# Altium schematic sheet motor-drive.SchDoc
size A3
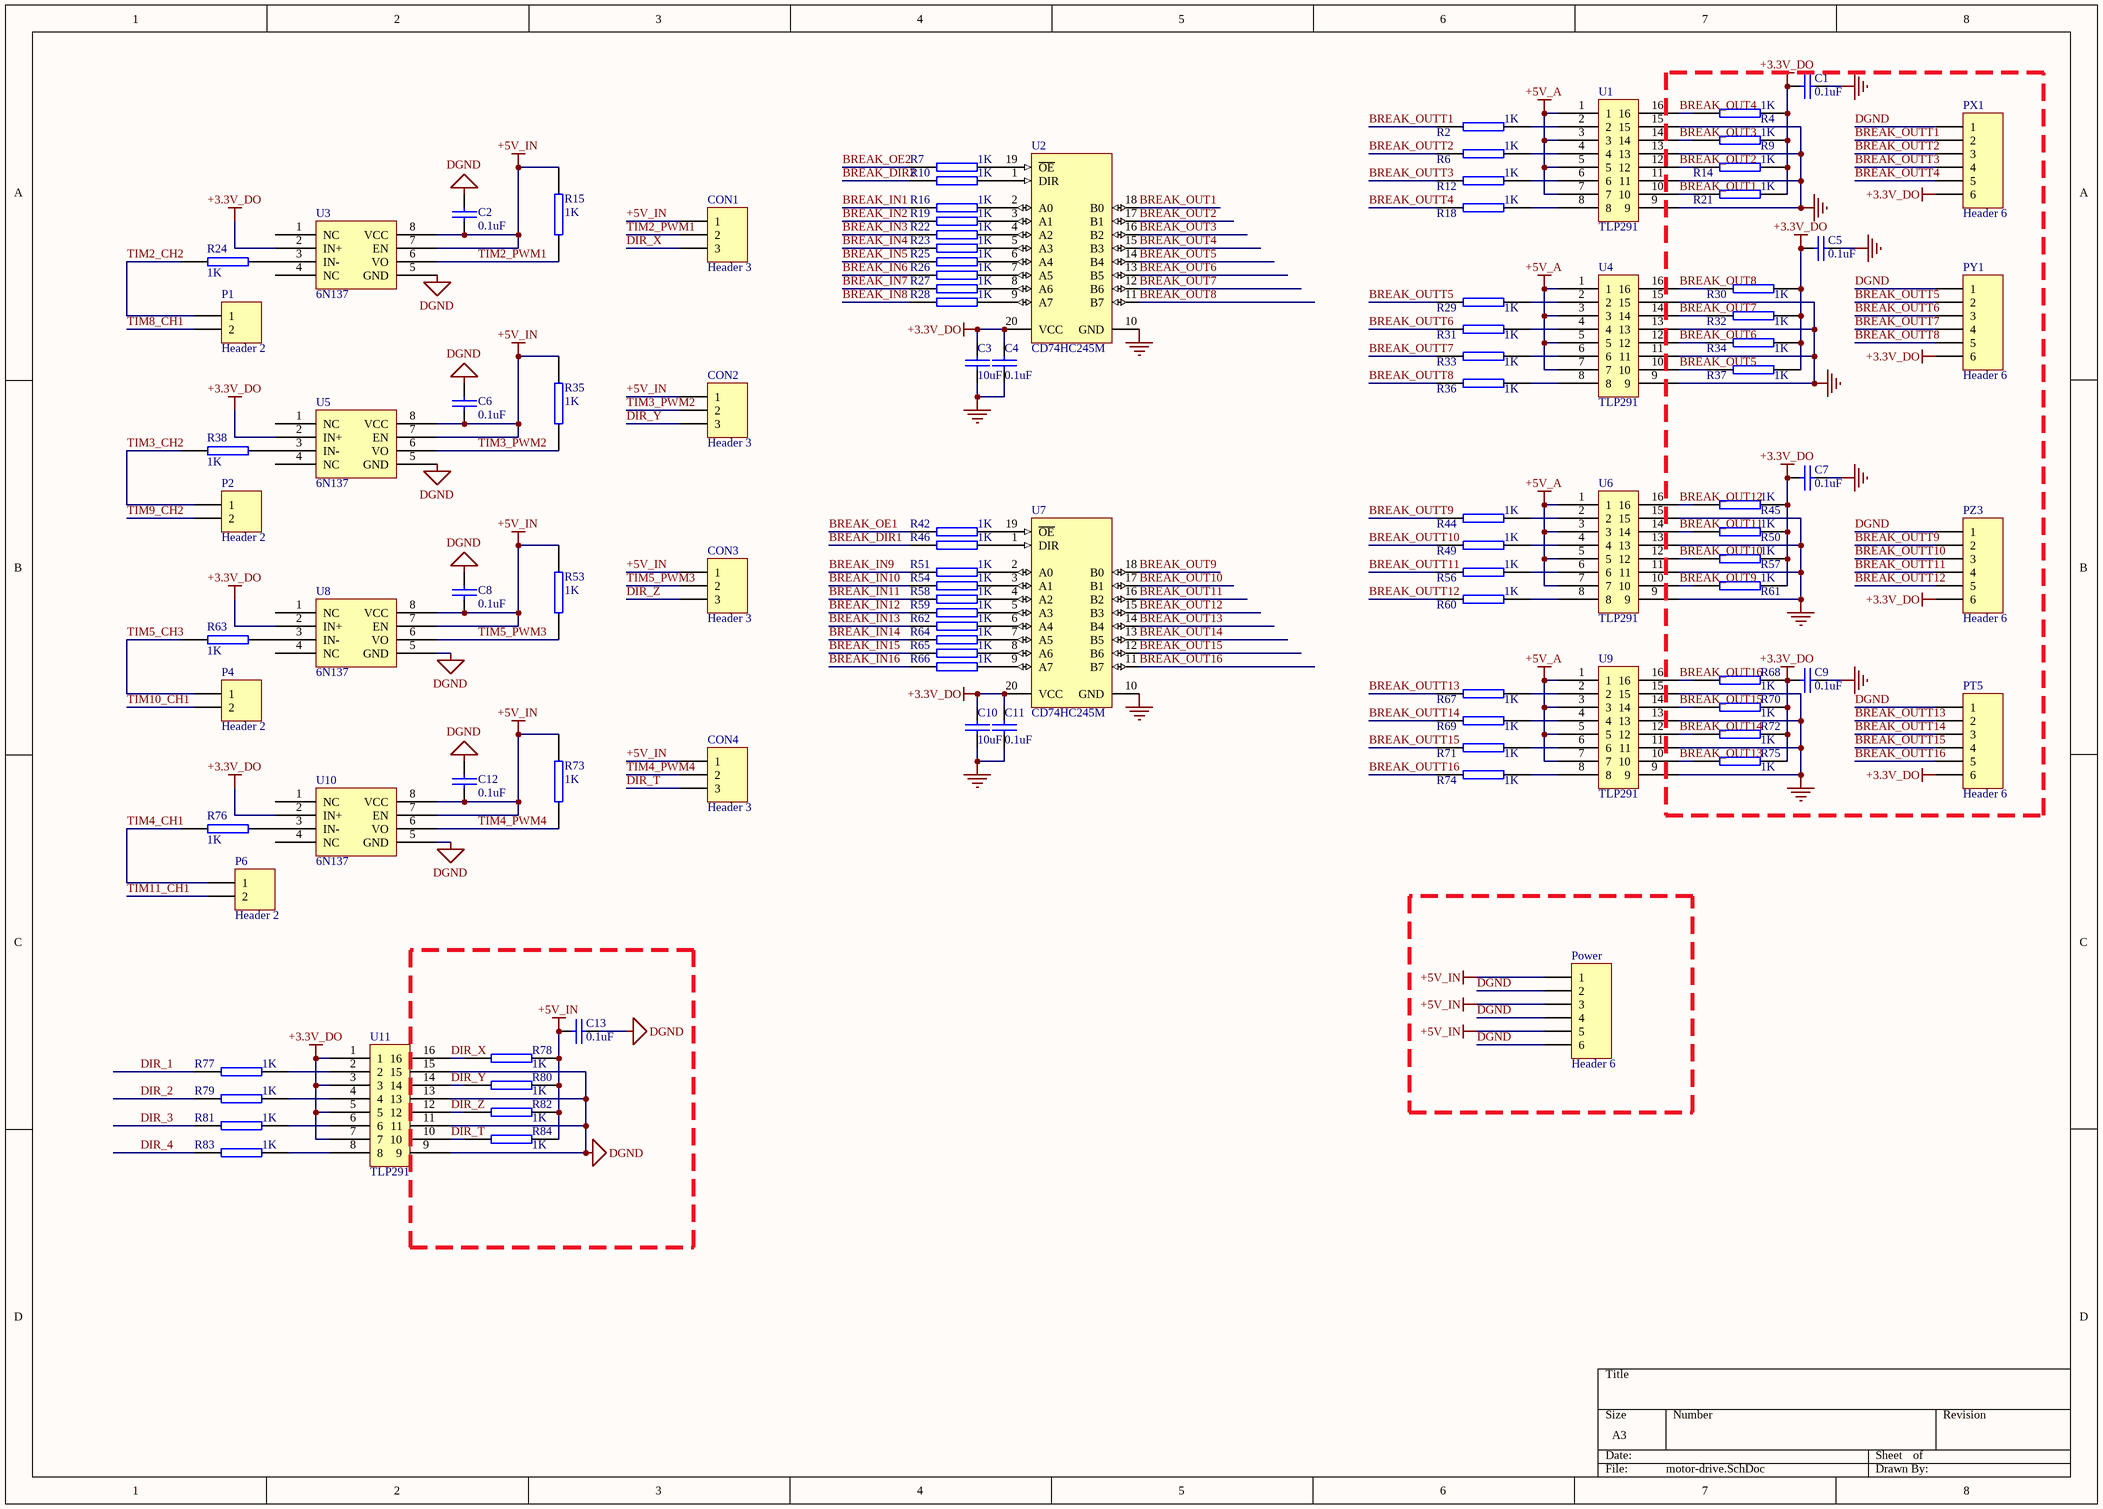
[diagram p0: motor-drive.SchDoc]

## Parts
C1  0.1uF  [0805]
C2  0.1uF  [0805]
C3  10uF  [0805]
C4  0.1uF  [0805]
C5  0.1uF  [0805]
C6  0.1uF  [0805]
C7  0.1uF  [0805]
C8  0.1uF  [0805]
C9  0.1uF  [0805]
C10  10uF  [0805]
C11  0.1uF  [0805]
C12  0.1uF  [0805]
C13  0.1uF  [0805]
CON1  Header 3  [CON3]
CON2  Header 3  [CON3]
CON3  Header 3  [CON3]
CON4  Header 3  [CON3]
P1  Header 2  [HDR1X2]
P2  Header 2  [HDR1X2]
P4  Header 2  [HDR1X2]
P6  Header 2  [HDR1X2]
Power  Header 6  [HDR1X6]
PT5  Header 6  [HDR1X6]
PX1  Header 6  [HDR1X6]
PY1  Header 6  [HDR1X6]
PZ3  Header 6  [HDR1X6]
R2  1K  [0805]
R4  1K  [0805]
R6  1K  [0805]
R7  1K  [0805]
R9  1K  [0805]
R10  1K  [0805]
R12  1K  [0805]
R14  1K  [0805]
R15  1K  [0805]
R16  1K  [0805]
R18  1K  [0805]
R19  1K  [0805]
R21  1K  [0805]
R22  1K  [0805]
R23  1K  [0805]
R24  1K  [0805]
R25  1K  [0805]
R26  1K  [0805]
R27  1K  [0805]
R28  1K  [0805]
R29  1K  [0805]
R30  1K  [0805]
R31  1K  [0805]
R32  1K  [0805]
R33  1K  [0805]
R34  1K  [0805]
R35  1K  [0805]
R36  1K  [0805]
R37  1K  [0805]
R38  1K  [0805]
R42  1K  [0805]
R44  1K  [0805]
R45  1K  [0805]
R46  1K  [0805]
R49  1K  [0805]
R50  1K  [0805]
R51  1K  [0805]
R53  1K  [0805]
R54  1K  [0805]
R56  1K  [0805]
R57  1K  [0805]
R58  1K  [0805]
R59  1K  [0805]
R60  1K  [0805]
R61  1K  [0805]
R62  1K  [0805]
R63  1K  [0805]
R64  1K  [0805]
R65  1K  [0805]
R66  1K  [0805]
R67  1K  [0805]
R68  1K  [0805]
R69  1K  [0805]
R70  1K  [0805]
R71  1K  [0805]
R72  1K  [0805]
R73  1K  [0805]
R74  1K  [0805]
R75  1K  [0805]
R76  1K  [0805]
R77  1K  [0805]
R78  1K  [0805]
R79  1K  [0805]
R80  1K  [0805]
R81  1K  [0805]
R82  1K  [0805]
R83  1K  [0805]
R84  1K  [0805]
U1  TLP291  [SOIC-TLP291-4-16N]
U2  CD74HC245M  [DW0020A_N]
U3  6N137  [SO-8]
U4  TLP291  [SOIC-TLP291-4-16N]
U5  6N137  [SO-8]
U6  TLP291  [SOIC-TLP291-4-16N]
U7  CD74HC245M  [DW0020A_N]
U8  6N137  [SO-8]
U9  TLP291  [SOIC-TLP291-4-16N]
U10  6N137  [SO-8]
U11  TLP291  [SOIC-TLP291-4-16N]

## Nets
+3.3V_DO: C1.1 C3.1 C4.2 C5.1 C7.1 C9.1 C10.1 C11.2 PT5.6 PX1.6 PY1.6 PZ3.6 R4.1 R9.1 R14.1 R21.1 R30.1 R32.1 R34.1 R37.1 R45.1 R50.1 R57.1 R61.1 R68.1 R70.1 R72.1 R75.1 U2.20(VCC) U3.2(IN+) U5.2(IN+) U7.20(VCC) U8.2(IN+) U10.2(IN+) U11.1 U11.3 U11.5 U11.7
+5V_A: U1.1 U1.3 U1.5 U1.7 U4.1 U4.3 U4.5 U4.7 U6.1 U6.3 U6.5 U6.7 U9.1 U9.3 U9.5 U9.7
+5V_IN: C2.2 C6.2 C8.2 C12.2 C13.1 CON1.1 CON2.1 CON3.1 CON4.1 Power.1 Power.3 Power.5 R15.2 R35.2 R53.2 R73.2 R78.2 R80.1 R82.1 R84.1 U3.7(EN) U3.8(VCC) U5.7(EN) U5.8(VCC) U8.7(EN) U8.8(VCC) U10.7(EN) U10.8(VCC)
DGND: C1.2 C2.1 C3.2 C4.1 C5.2 C6.1 C7.2 C8.1 C9.2 C10.2 C11.1 C12.1 C13.2 Power.2 Power.4 Power.6 PT5.1 PX1.1 PY1.1 PZ3.1 U1.9 U1.11 U1.13 U1.15 U2.10(GND) U3.5(GND) U4.9 U4.11 U4.13 U4.15 U5.5(GND) U6.9 U6.11 U6.13 U6.15 U7.10(GND) U8.5(GND) U9.9 U9.11 U9.13 U9.15 U10.5(GND) U11.9 U11.11 U11.13 U11.15
BREAK_DIR1: R46.1
BREAK_DIR2: R10.1
BREAK_IN1: R16.1
BREAK_IN2: R19.1
BREAK_IN3: R22.1
BREAK_IN4: R23.1
BREAK_IN5: R25.1
BREAK_IN6: R26.1
BREAK_IN7: R27.1
BREAK_IN8: R28.1
BREAK_IN9: R51.1
BREAK_IN10: R54.1
BREAK_IN11: R58.1
BREAK_IN12: R59.1
BREAK_IN13: R62.1
BREAK_IN14: R64.1
BREAK_IN15: R65.1
BREAK_IN16: R66.1
BREAK_OE1: R42.1
BREAK_OE2: R7.1
BREAK_OUT1: R21.2 U1.10 U2.18(B0)
BREAK_OUT2: R14.2 U1.12 U2.17(B1)
BREAK_OUT3: R9.2 U1.14 U2.16(B2)
BREAK_OUT4: R4.2 U1.16 U2.15(B3)
BREAK_OUT5: R37.2 U2.14(B4) U4.10
BREAK_OUT6: R34.2 U2.13(B5) U4.12
BREAK_OUT7: R32.2 U2.12(B6) U4.14
BREAK_OUT8: R30.2 U2.11(B7) U4.16
BREAK_OUT9: R61.2 U6.10 U7.18(B0)
BREAK_OUT10: R57.2 U6.12 U7.17(B1)
BREAK_OUT11: R50.2 U6.14 U7.16(B2)
BREAK_OUT12: R45.2 U6.16 U7.15(B3)
BREAK_OUT13: R75.2 U7.14(B4) U9.10
BREAK_OUT14: R72.2 U7.13(B5) U9.12
BREAK_OUT15: R70.2 U7.12(B6) U9.14
BREAK_OUT16: R68.2 U7.11(B7) U9.16
BREAK_OUTT1: PX1.2 R2.2
BREAK_OUTT2: PX1.3 R6.2
BREAK_OUTT3: PX1.4 R12.2
BREAK_OUTT4: PX1.5 R18.2
BREAK_OUTT5: PY1.2 R29.2
BREAK_OUTT6: PY1.3 R31.2
BREAK_OUTT7: PY1.4 R33.2
BREAK_OUTT8: PY1.5 R36.2
BREAK_OUTT9: PZ3.2 R44.2
BREAK_OUTT10: PZ3.3 R49.2
BREAK_OUTT11: PZ3.4 R56.2
BREAK_OUTT12: PZ3.5 R60.2
BREAK_OUTT13: PT5.2 R67.2
BREAK_OUTT14: PT5.3 R69.2
BREAK_OUTT15: PT5.4 R71.2
BREAK_OUTT16: PT5.5 R74.2
DIR_1: R77.2
DIR_2: R79.2
DIR_3: R81.2
DIR_4: R83.2
DIR_T: CON4.3 R84.2 U11.10
DIR_X: CON1.3 R78.1 U11.16
DIR_Y: CON2.3 R80.2 U11.14
DIR_Z: CON3.3 R82.2 U11.12
TIM2_CH2: P1.1 R24.1
TIM2_PWM1: CON1.2 R15.1 U3.6(VO)
TIM3_CH2: P2.1 R38.1
TIM3_PWM2: CON2.2 R35.1 U5.6(VO)
TIM4_CH1: P6.1 R76.1
TIM4_PWM4: CON4.2 R73.1 U10.6(VO)
TIM5_CH3: P4.1 R63.1
TIM5_PWM3: CON3.2 R53.1 U8.6(VO)
TIM8_CH1: P1.2
TIM9_CH2: P2.2
TIM10_CH1: P4.2
TIM11_CH1: P6.2
NetR2_1: R2.1 U1.2
NetR6_1: R6.1 U1.4
NetR7_2: R7.2 U2.19(~{OE})
NetR10_2: R10.2 U2.1(DIR)
NetR12_1: R12.1 U1.6
NetR16_2: R16.2 U2.2(A0)
NetR18_1: R18.1 U1.8
NetR19_2: R19.2 U2.3(A1)
NetR22_2: R22.2 U2.4(A2)
NetR23_2: R23.2 U2.5(A3)
NetR24_2: R24.2 U3.3(IN-)
NetR25_2: R25.2 U2.6(A4)
NetR26_2: R26.2 U2.7(A5)
NetR27_2: R27.2 U2.8(A6)
NetR28_2: R28.2 U2.9(A7)
NetR29_1: R29.1 U4.2
NetR31_1: R31.1 U4.4
NetR33_1: R33.1 U4.6
NetR36_1: R36.1 U4.8
NetR38_2: R38.2 U5.3(IN-)
NetR42_2: R42.2 U7.19(~{OE})
NetR44_1: R44.1 U6.2
NetR46_2: R46.2 U7.1(DIR)
NetR49_1: R49.1 U6.4
NetR51_2: R51.2 U7.2(A0)
NetR54_2: R54.2 U7.3(A1)
NetR56_1: R56.1 U6.6
NetR58_2: R58.2 U7.4(A2)
NetR59_2: R59.2 U7.5(A3)
NetR60_1: R60.1 U6.8
NetR62_2: R62.2 U7.6(A4)
NetR63_2: R63.2 U8.3(IN-)
NetR64_2: R64.2 U7.7(A5)
NetR65_2: R65.2 U7.8(A6)
NetR66_2: R66.2 U7.9(A7)
NetR67_1: R67.1 U9.2
NetR69_1: R69.1 U9.4
NetR71_1: R71.1 U9.6
NetR74_1: R74.1 U9.8
NetR76_2: R76.2 U10.3(IN-)
NetR77_1: R77.1 U11.2
NetR79_1: R79.1 U11.4
NetR81_1: R81.1 U11.6
NetR83_1: R83.1 U11.8

Not connected (* = marked no-connect by the designer): U3 1(NC) 4(NC); U5 1(NC) 4(NC); U8 1(NC) 4(NC); U10 1(NC) 4(NC)

## Library data of the parts
C1-C13 = CAP: Capacitor
CON1-CON4 = Header 3: Header, 3-Pin; Revision: 17-Jul-2002: Re-released for DXP Platform.; Publisher: Altium Limited
P1 P2 P4 P6 = Header 2: Header, 2-Pin; LatestRevisionDate: 17-Jul-2002; LatestRevisionNote: Re-released for DXP Platform.; Publisher: Altium Limited
Power PT5 PX1 PY1 PZ3 = Header 6: Header, 6-Pin; LatestRevisionDate: 17-Jul-2002; LatestRevisionNote: Re-released for DXP Platform.; Publisher: Altium Limited
R2 R4 R6 R7 R9 R10 R12 R14-R16 R18 R19 R21-R38 R42 R44-R46 R49-R51 R53 R54 R56-R84 = RES2
U1 U4 U6 U9 U11 = TLP291-4: 光耦隔离
U2 U7 = CD74HC245M: High Speed CMOS Logic Non-Inverting Octal-Bus Transceivers with 3-State Outputs, DW0020A, TUBE; Manufacturer: Texas Instruments; VCC(Min)(V): 2; VCC(Max)(V): 6; ICC @ Nom Voltage(Max)(mA): 0.08; Bits(#): 8; F @ Nom Voltage(Max)(Mhz): 29; Rating: Catalog; Technology Family: HC; Schmitt Trigger: No; Output Drive (IOL/IOH)(Max)(mA): -5.2/5.2; tpd @ Nom Voltage(Max)(ns): 24; DatasheetVersion: SCHS119A; PackageReference: DW0020A; Supplier 1: Digi-Key; Supplier Part Number 1: 296-9421-5-ND; Supplier 2: Farnell; Supplier Part Number 2: 1103163; Supplier 3: Newark; Supplier Part Number 3: 25M8636; Supplier 4: Mouser; Supplier Part Number 4: 595-CD74HC245M; Generic Part Number: CD74HC245; Output Type: CMOS; Input Type: CMOS; Operating Temperature Range(C): -55 to 125; Voltage(Nom)(V): 6; PartNumber: CD74HC245M; ComponentLink1Description: Manufacturer URL; ComponentLink1URL: http://www.ti.com/; ComponentLink2Description: Datasheet; ComponentLink2URL: http://www.ti.com/lit/ds/symlink/cd74hc245.pdf; ComponentLink3Description: Package Specification; ComponentLink3URL: http://www.ti.com/lit/ml/mpds173a/mpds173a.pdf
U3 U5 U8 U10 = HCPL2400